# EasyEDA schematic section2.json
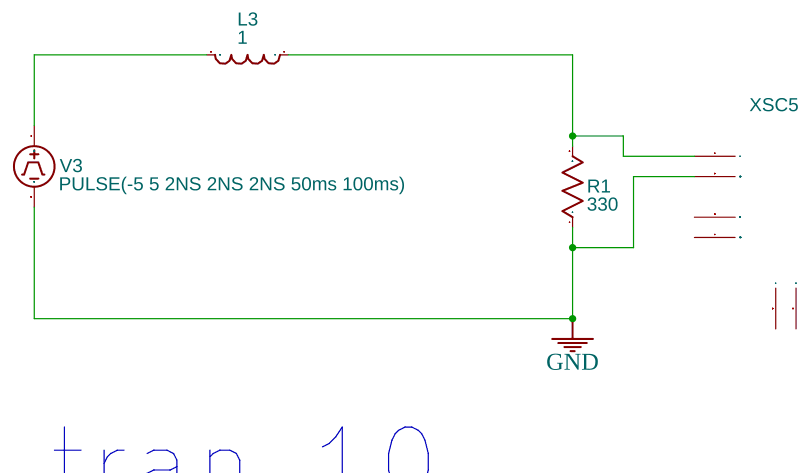
[diagram p0: schematic sheet]

## Parts
L3  1  [AXIAL-0.4]
R1  330  [AXIAL-0.3]
V3  PULSE(-5 5 2NS 2NS 2NS 50ms 100ms)  [HDR1X2]
XSC5  Oscilloscope

## Library data of the parts
L3 = Inductor: Supplier: YUJING; Contributor: EasyEDA; Inductance: 1m
R1 = Resistor_US: Resistance: 1k; Contributor: EasyEDA; Supplier: YUJING
V3 = VPULSE: Contributor: EasyEDA; sim: true
XSC5 = OSCILLOSCOPE: Contributor: EasyEDA; NameDisplay: 0; sim: true

## Nets
GND: R1.1 V3.2 XSC5.2(GND1)
Net-(L3-1): L3.1 R1.2 XSC5.1(A)
Net-(L3-2): L3.2 V3.1

Not connected (* = marked no-connect by the designer): XSC5 3(B) 4(GND2) 5(T+) 6(T-)

## Notes on the sheet
- .tran 10
